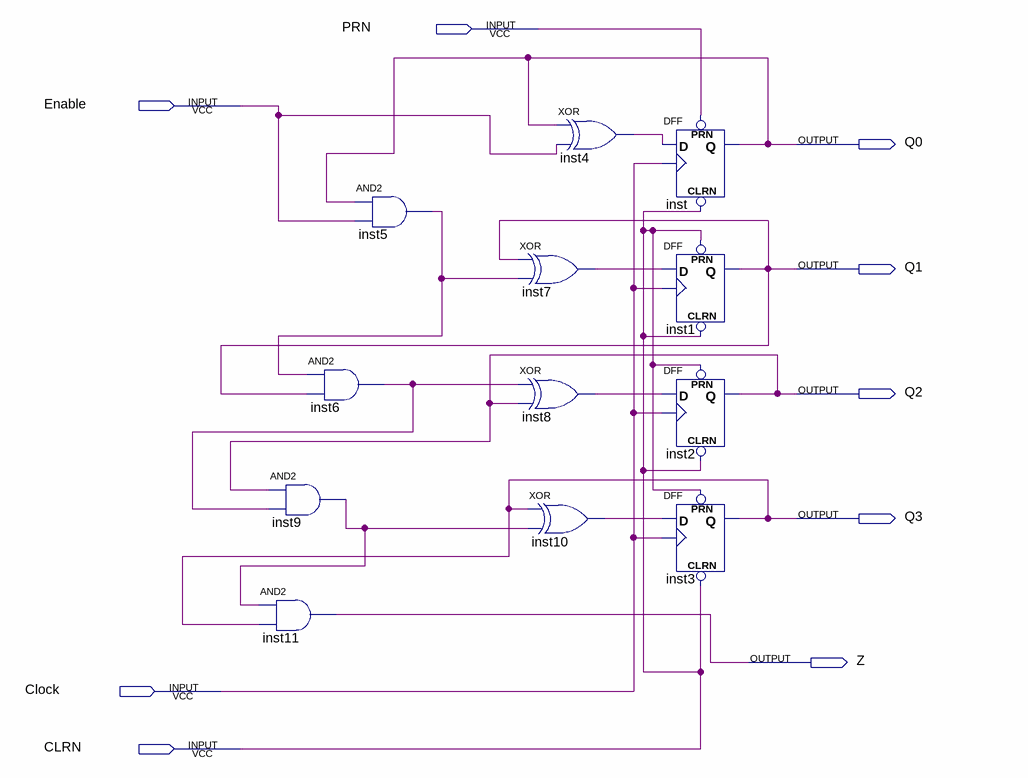
[diagram p0: schematic sheet]
// Quartus schematic lab10step2a.bdf as structural Verilog: 12 symbols, 9 pins
module lab10step2a (
  input  PRN,
  input  Enable,
  input  Clock,
  input  CLRN,
  output Q0,
  output Q1,
  output Q2,
  output Q3,
  output Z
);

  wire inst4_out, inst5_out, inst6_out, inst7_out, inst8_out, inst9_out, inst10_out;

  and inst11 (Z, inst9_out, Q3);
  and inst6 (inst6_out, inst5_out, Q1);
  and inst9 (inst9_out, Q2, inst6_out);
  and inst5 (inst5_out, Q0, Enable);
  xor inst4 (inst4_out, Q0, Enable);
  xor inst7 (inst7_out, Q1, inst5_out);
  xor inst8 (inst8_out, inst6_out, Q2);
  xor inst10 (inst10_out, Q3, inst9_out);
  DFF inst (.CLRN(CLRN), .CLK(Clock), .D(inst4_out), .PRN(PRN), .Q(Q0));
  DFF inst1 (.CLRN(CLRN), .CLK(Clock), .D(inst7_out), .PRN(CLRN), .Q(Q1));
  DFF inst2 (.CLRN(CLRN), .CLK(Clock), .D(inst8_out), .PRN(CLRN), .Q(Q2));
  DFF inst3 (.CLRN(CLRN), .CLK(Clock), .D(inst10_out), .PRN(CLRN), .Q(Q3));
endmodule
